# Altium schematic sheet H_bridge.SchDoc
size A
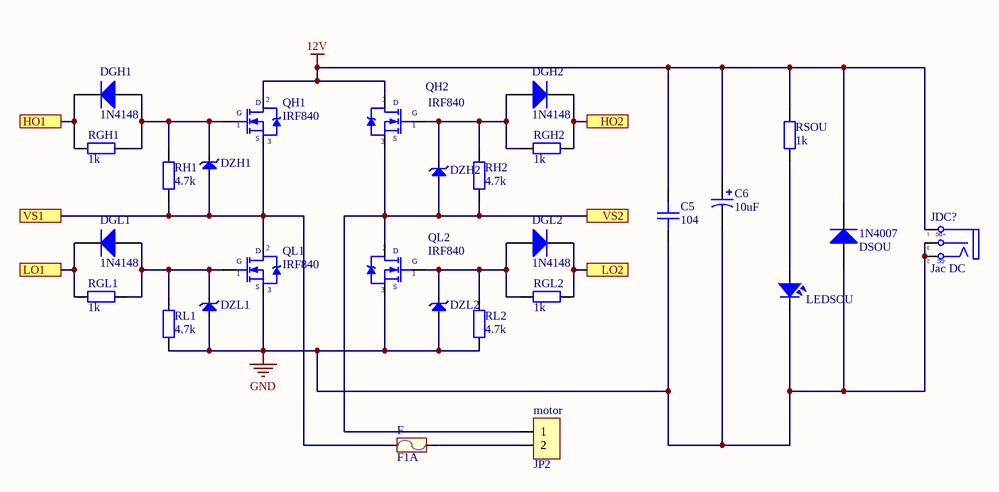
[diagram p0: H_bridge.SchDoc]

## Parts
1N4007  DSOU  [DIODE_DO214AC_SMA]
C5  104  [CAPC-0603 (1608)]
C6  10uF  [CAP_ALUM_SMT_NICHICON_H8xH10]
DGH1  1N4148  [SOD-123]
DGH2  1N4148  [SOD-123]
DGL1  1N4148  [SOD-123]
DGL2  1N4148  [SOD-123]
DZH1  DIODE Zener  [DIO-0.5A-SMALL]  (value not drawn)
DZH2  DIODE Zener  [DIO-0.5A-SMALL]  (value not drawn)
DZL1  DIODE Zener  [DIO-0.5A-SMALL]  (value not drawn)
DZL2  DIODE Zener  [DIO-0.5A-SMALL]  (value not drawn)
F  F1A  [Fuse]
JDC?  Jac DC  [DC-IN]
LEDSOU  LED  [LED-3]  (value not drawn)
motor  JP2  [JP2-C1T]
QH1  IRF840  [QTO-220]
QH2  IRF840  [QTO-220]
QL1  IRF840  [QTO-220]
QL2  IRF840  [QTO-220]
RGH1  1k  [RESC-0603 (1608)]
RGH2  1k  [RESC-0603 (1608)]
RGL1  1k  [RESC-0603 (1608)]
RGL2  1k  [RESC-0603 (1608)]
RH1  4.7k  [RESC-0603 (1608)]
RH2  4.7k  [RESC-0603 (1608)]
RL1  4.7k  [RESC-0603 (1608)]
RL2  4.7k  [RESC-0603 (1608)]
RSOU  1k  [RESC-0603 (1608)]

## Ports
HO1, HO2, LO1, LO2, VS1, VS2

## Nets
12V: 1N4007.2(K) C5.2 C6.1 JDC?.1(T) QH1.2(D) QH2.2(D) RSOU.2
GND: 1N4007.1(A) C5.1 C6.2 DZL1.1(A) DZL2.1(A) JDC?.2(TN) JDC?.3(S) LEDSOU.2 QL1.3(S) QL2.3(S) RL1.1 RL2.1
HO1: DGH1.2(K) RGH1.2 ; port HO1
HO2: DGH2.2(K) RGH2.1 ; port HO2
LO1: DGL1.2(K) RGL1.2 ; port LO1
LO2: DGL2.2(K) RGL2.1 ; port LO2
VS1: DZH1.1(A) F.1 QH1.3(S) QL1.2(D) RH1.1 ; port VS1
VS2: DZH2.1(A) motor.1 QH2.3(S) QL2.2(D) RH2.1 ; port VS2
NetDGH1_1: DGH1.1(A) DZH1.2(K) QH1.1(G) RGH1.1 RH1.2
NetDGH2_1: DGH2.1(A) DZH2.2(K) QH2.1(G) RGH2.2 RH2.2
NetDGL1_1: DGL1.1(A) DZL1.2(K) QL1.1(G) RGL1.1 RL1.2
NetDGL2_1: DGL2.1(A) DZL2.2(K) QL2.1(G) RGL2.2 RL2.2
NetF_2: F.2 motor.2
NetLEDSOU_1: LEDSOU.1 RSOU.1

## Notes on the sheet
- (in symbol DCIN) +DC; -DC

## Library data of the parts
1N4007 = 1N4007_SMA: DIODE GEN PURP 1KV 1A SMA; MPN: MRA4007T3G; Solder: SMT; Value: 1000V/1A; MFR: *
C5 = 0603N331J500CT: CAP CER 330PF 50V C0G/NP0 0603; MFR: Walsin Technology Corporation; Solder: SMT; Value: 330p/50V; MPN: 0603N331J500CT; Category: CAPACITOR; PinCount: 2
C6 = UWT1H101MNL1GS: CAP ALUM 100UF 20% 50V SMD; Value: 100uF/50V; Solder: SMT; MPN: UWT1H101MNL1GS; Category: CAPACITOR; PinCount: 2
DGH1 DGH2 DGL1 DGL2 = 1N4148-W-7: DIODE GEN PURP 100V 300MA SOD123; MPN: 1N4148W-7-F; MFR: Diodes Incorporated; Solder: SMT; Value: 100V/300MA
DZH1 DZH2 DZL1 DZL2 = DIODE Zener: Zenner
F = Fuse: Designed by: VanDungEvn; Value: Fuse
JDC? = DCIN: Jac DC input; Value: Jac DC
LEDSOU = LED: LED Single colour Green and Red; Value: LED 3 ly Single Colour
motor = JP2: WR-PHD 2.54 mm Angled Socket Header; Manufacturer: W¨¹rth Elektronik eiSos GmbH; partNo: 613002143121; ComponentLink1 Description: Manufacturer; ComponentLink2 Description: Datasheet; NoPins: 02; Created Date: 29 March 2013; ComponentLink1URL: http://www.we-online.com; ComponentLink2URL: http://katalog.we-online.de/em/datasheet/6130xx143121.pdf; Created by: Karrer Zheng
QH1 QH2 QL1 QL2 = IRF840: MOSFET N - CHANNEL 500V - 0.75 - 8A - TO-220; Value: IRF840
RGH1 RGH2 RGL1 RGL2 RH1 RH2 RL1 RL2 RSOU = RESC NF 0603: RES SMD, Not Fill, 0603; Value: NF; Solder: Not Fill; Category: RESISTOR